# Altium project stm32f103cb_hm.PrjPcb (part 1 of 2)
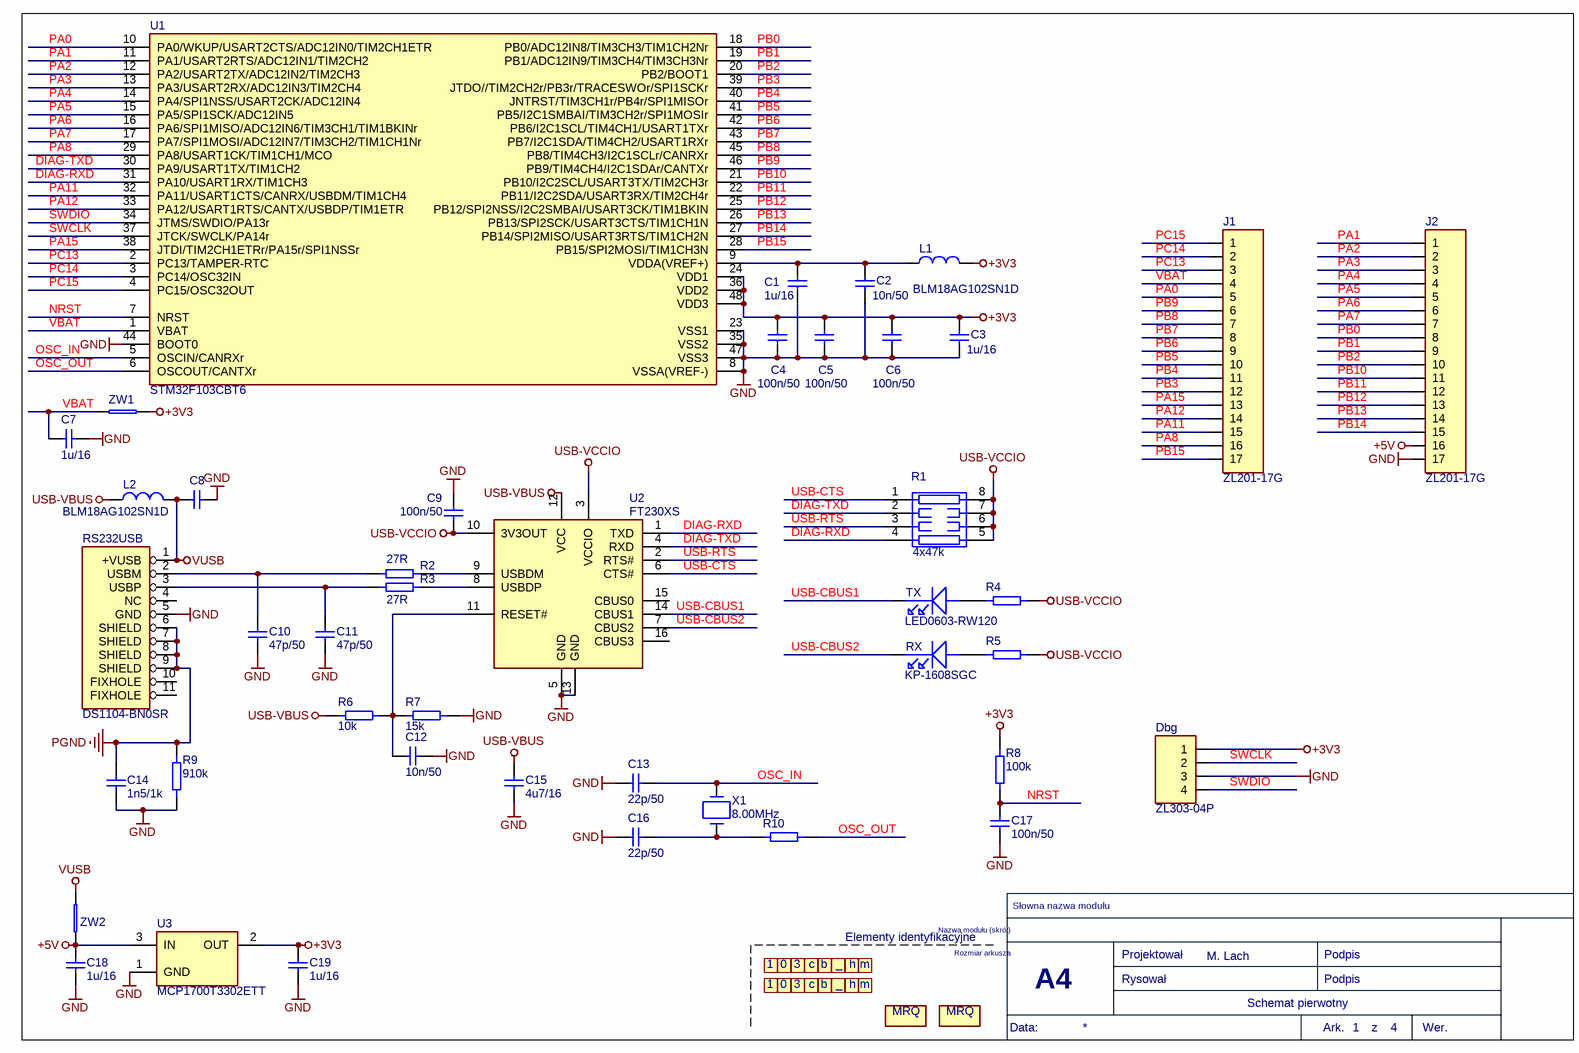
[diagram p0: stm32f103cb_hm_main.SchDoc]
Projektowal: M. Lach
4 sheets, 189 parts. Net scope: global (net labels, ports and power ports of the same name join across sheets).
Board file: stm32f103cb_hm.PcbDoc
Sheets:
  stm32f103cb_hm_main.SchDoc
  stm32f103cb_hm_F100.SchDoc
  stm32f103cb_hm_L073.SchDoc
  stm32f103cb_hm_F051.SchDoc

## Sheet stm32f103cb_hm_main.SchDoc: Schemat pierwotny
size A4; DocumentNumber: 1; SheetNumber: 1; SheetTotal: 4; LotOfPieces: 1

### Parts
(Parts that share a designator on the sheet are numbered #1, #2 ... from top to bottom, then left to right.)
C1#1  1u/16  [0603-IPC]
C2#1  10n/50  [0603-IPC]
C3#1  1u/16  [0603-IPC]
C4#1  100n/50  [0603-IPC]
C5#1  100n/50  [0603-IPC]
C6#1  100n/50  [0603-IPC]
C7#1  1u/16  [0603-IPC]
C8#1  10n/50  [0603-IPC]  (value not drawn)
C9#1  100n/50  [0603-IPC]
C10#1  47p/50  [0603-IPC]
C11#1  47p/50  [0603-IPC]
C12#1  10n/50  [0603-IPC]
C13#1  22p/50  [0603-IPC]
C14#1  1n5/1k  [1210]
C15#1  4u7/16  [0805]
C16#1  22p/50  [0603-IPC]
C17#1  100n/50  [0603-IPC]
C18#1  1u/16  [0603-IPC]
C19  1u/16  [0603-IPC]
Dbg#1  ZL303-04P  [PLMS4S]
J1#1  ZL201-17G  [PLS17S]
J2#1  ZL201-17G  [PLS17S]
L1#1  BLM18AG102SN1D  [0603-IPC]
L2#1  BLM18AG102SN1D  [0603-IPC]
LETTER1  LETTER_1_1m2_m2  [LETTER_1_1m2_m2]  (value not drawn)  (no BOM)
LETTER2  LETTER_0_1m2_m2  [LETTER_0_1m2_m2]  (value not drawn)  (no BOM)
LETTER3  LETTER_3_1m2_m2  [LETTER_3_1m2_m2]  (value not drawn)  (no BOM)
LETTER4  LETTER_C_1m2_m2  [LETTER_C_1m2_m2]  (value not drawn)  (no BOM)
LETTER5  LETTER_B_1M2_M2  [LETTER_B_1M2_M2]  (value not drawn)  (no BOM)
LETTER6  LETTER_UNDERSCORE_1M2_M2  [LETTER_UNDERSCORE_1M2_M2]  (value not drawn)  (no BOM)
LETTER7  LETTER_H_1M2_M2  [LETTER_H_1M2_M2]  (value not drawn)  (no BOM)
LETTER8  LETTER_M_1M2_M2  [LETTER_M_1M2_M2]  (value not drawn)  (no BOM)
LETTER9  LETTER_1_1m2_m2  [LETTER_1_1m2_m2]  (value not drawn)  (no BOM)
LETTER10  LETTER_0_1m2_m2  [LETTER_0_1m2_m2]  (value not drawn)  (no BOM)
LETTER11  LETTER_3_1m2_m2  [LETTER_3_1m2_m2]  (value not drawn)  (no BOM)
LETTER12  LETTER_C_1m2_m2  [LETTER_C_1m2_m2]  (value not drawn)  (no BOM)
LETTER13  LETTER_B_1M2_M2  [LETTER_B_1M2_M2]  (value not drawn)  (no BOM)
LETTER14  LETTER_UNDERSCORE_1M2_M2  [LETTER_UNDERSCORE_1M2_M2]  (value not drawn)  (no BOM)
LETTER15  LETTER_H_1M2_M2  [LETTER_H_1M2_M2]  (value not drawn)  (no BOM)
LETTER16  LETTER_M_1M2_M2  [LETTER_M_1M2_M2]  (value not drawn)  (no BOM)
LOGO1  MRQ_2_8  [MRQ_2_8]  (value not drawn)  (no BOM)
LOGO2  MRQ_2_8  [MRQ_2_8]  (value not drawn)  (no BOM)
R1#1  4x47k  [1206RP]
R2#1  27R  [0603R]
R3#1  27R  [0603R]
R4#1  10k  [0603R]  (value not drawn)
R5#1  10k  [0603R]  (value not drawn)
R6#1  10k  [0603R]
R7#1  15k  [0603R]
R8#1  100k  [0603R]
R9#1  910k  [2512]
R10#1  220R  [0603R]  (value not drawn)
RS232USB  DS1104-BN0SR  [USBMS1B5]
RX#1  KP-1608SGC  [D0603]
TX#1  LED0603-RW120  [D0603]
U1#1  STM32F103CBT6  [MS-026ABC]
U2#1  FT230XS  [MO-137AB]
U3#1  MCP1700T3302ETT  [SOT23-3]
X1#1  8.00MHz  [HC49/4HSMX_THT]
ZW1#1  SHORT0805  [SHORT0805]  (value not drawn)
ZW2#1  SHORT0805  [SHORT0805]  (value not drawn)

### Nets
+3V3: C3#1.1 C4#1.1 C5#1.1 C6#1.1 C19.1 Dbg#1.1 L1#1.2 R8#1.1 U1#1.24(VDD1) U1#1.36(VDD2) U1#1.48(VDD3) U3#1.2(OUT) ZW1#1.2
+5V: C18#1.1 J2#1.16 U3#1.3(IN) ZW2#1.1
GND: C1#1.2 C2#1.2 C3#1.2 C4#1.2 C5#1.2 C6#1.2 C7#1.2 C8#1.1 C9#1.1 C10#1.2 C11#1.2 C12#1.1 C13#1.1 C14#1.2 C15#1.2 C16#1.1 C17#1.2 C18#1.2 C19.2 Dbg#1.3 J2#1.17 R7#1.2 R9#1.2 RS232USB.5(GND) U1#1.8(VSSA(VREF-)) U1#1.23(VSS1) U1#1.35(VSS2) U1#1.44(BOOT0) U1#1.47(VSS3) U2#1.5(GND) U2#1.13(GND) U3#1.1(GND)
PGND: C14#1.1 R9#1.1 RS232USB.6(SHIELD) RS232USB.7(SHIELD) RS232USB.8(SHIELD) RS232USB.9(SHIELD)
USB-VBUS: C15#1.1 L2#1.2 R6#1.1 U2#1.12(VCC)
USB-VCCIO: C9#1.2 R1#1.5(R5) R1#1.6(R6) R1#1.7(R7) R1#1.8(R8) R4#1.2 R5#1.2 U2#1.3(VCCIO) U2#1.10(3V3OUT)
VUSB: C8#1.2 L2#1.1 RS232USB.1(+VUSB) ZW2#1.2
DIAG-RXD: R1#1.4(R4) U1#1.31(PA10/USART1RX/TIM1CH3) U2#1.1(TXD)
DIAG-TXD: R1#1.2(R2) U1#1.30(PA9/USART1TX/TIM1CH2) U2#1.4(RXD)
NRST: C17#1.1 R8#1.2 U1#1.7(NRST)
OSC_IN: C13#1.2 U1#1.5(OSCIN/CANRXr) X1#1.1
OSC_OUT: R10#1.2 U1#1.6(OSCOUT/CANTXr)
PA0: J1#1.5 U1#1.10(PA0/WKUP/USART2CTS/ADC12IN0/TIM2CH1ETR)
PA1: J2#1.1 U1#1.11(PA1/USART2RTS/ADC12IN1/TIM2CH2)
PA2: J2#1.2 U1#1.12(PA2/USART2TX/ADC12IN2/TIM2CH3)
PA3: J2#1.3 U1#1.13(PA3/USART2RX/ADC12IN3/TIM2CH4)
PA4: J2#1.4 U1#1.14(PA4/SPI1NSS/USART2CK/ADC12IN4)
PA5: J2#1.5 U1#1.15(PA5/SPI1SCK/ADC12IN5)
PA6: J2#1.6 U1#1.16(PA6/SPI1MISO/ADC12IN6/TIM3CH1/TIM1BKINr)
PA7: J2#1.7 U1#1.17(PA7/SPI1MOSI/ADC12IN7/TIM3CH2/TIM1CH1Nr)
PA8: J1#1.16 U1#1.29(PA8/USART1CK/TIM1CH1/MCO)
PA11: J1#1.15 U1#1.32(PA11/USART1CTS/CANRX/USBDM/TIM1CH4)
PA12: J1#1.14 U1#1.33(PA12/USART1RTS/CANTX/USBDP/TIM1ETR)
PA15: J1#1.13 U1#1.38(JTDI/TIM2CH1ETRr/PA15r/SPI1NSSr)
PB0: J2#1.8 U1#1.18(PB0/ADC12IN8/TIM3CH3/TIM1CH2Nr)
PB1: J2#1.9 U1#1.19(PB1/ADC12IN9/TIM3CH4/TIM3CH3Nr)
PB2: J2#1.10 U1#1.20(PB2/BOOT1)
PB3: J1#1.12 U1#1.39(JTDO//TIM2CH2r/PB3r/TRACESWOr/SPI1SCKr)
PB4: J1#1.11 U1#1.40(JNTRST/TIM3CH1r/PB4r/SPI1MISOr)
PB5: J1#1.10 U1#1.41(PB5/I2C1SMBAI/TIM3CH2r/SPI1MOSIr)
PB6: J1#1.9 U1#1.42(PB6/I2C1SCL/TIM4CH1/USART1TXr)
PB7: J1#1.8 U1#1.43(PB7/I2C1SDA/TIM4CH2/USART1RXr)
PB8: J1#1.7 U1#1.45(PB8/TIM4CH3/I2C1SCLr/CANRXr)
PB9: J1#1.6 U1#1.46(PB9/TIM4CH4/I2C1SDAr/CANTXr)
PB10: J2#1.11 U1#1.21(PB10/I2C2SCL/USART3TX/TIM2CH3r)
PB11: J2#1.12 U1#1.22(PB11/I2C2SDA/USART3RX/TIM2CH4r)
PB12: J2#1.13 U1#1.25(PB12/SPI2NSS/I2C2SMBAI/USART3CK/TIM1BKIN)
PB13: J2#1.14 U1#1.26(PB13/SPI2SCK/USART3CTS/TIM1CH1N)
PB14: J2#1.15 U1#1.27(PB14/SPI2MISO/USART3RTS/TIM1CH2N)
PB15: J1#1.17 U1#1.28(PB15/SPI2MOSI/TIM1CH3N)
PC13: J1#1.3 U1#1.2(PC13/TAMPER-RTC)
PC14: J1#1.2 U1#1.3(PC14/OSC32IN)
PC15: J1#1.1 U1#1.4(PC15/OSC32OUT)
SWCLK: Dbg#1.2 U1#1.37(JTCK/SWCLK/PA14r)
SWDIO: Dbg#1.4 U1#1.34(JTMS/SWDIO/PA13r)
USB-CBUS1: TX#1.CATH U2#1.14(CBUS1)
USB-CBUS2: RX#1.CATH U2#1.7(CBUS2)
USB-CTS: R1#1.1(R1) U2#1.6(CTS#)
USB-RTS: R1#1.3(R3) U2#1.2(RTS#)
VBAT: C7#1.1 J1#1.4 U1#1.1(VBAT) ZW1#1.1
NetC1#1_1: C1#1.1 C2#1.1 L1#1.1 U1#1.9(VDDA(VREF+))
NetC10#1_1: C10#1.1 R2#1.1 RS232USB.2(USBM)
NetC11#1_1: C11#1.1 R3#1.1 RS232USB.3(USBP)
NetC12#1_2: C12#1.2 R6#1.2 R7#1.1 U2#1.11(RESET#)
NetC16#1_2: C16#1.2 R10#1.1 X1#1.2
NetR2#1_2: R2#1.2 U2#1.9(USBDM)
NetR3#1_2: R3#1.2 U2#1.8(USBDP)
NetR4#1_1: R4#1.1 TX#1.ANOD
NetR5#1_1: R5#1.1 RX#1.ANOD

Not connected (* = marked no-connect by the designer): RS232USB 4(NC) 10(FIXHOLE) 11(FIXHOLE); U2#1 15(CBUS0) 16(CBUS3)

### Notes on the sheet
- Elementy identyfikacyjne
- Nazwa modułu (skrót)
- Słowna nazwa modułu
- Rozmiar arkusza
- A4
- Projektował
- Rysował
- Podpis
- Data:
- Ark.
- z
- Wer.
- (in symbol NOB5) MRQ
- (in symbol NOB8) 0
- (in symbol NOB9) 1
- (in symbol NOB11) 3
- (in symbol NOB13) c
- (in symbol NOB15) b
- (in symbol NOB17) _
- (in symbol NOB19) h
- (in symbol NOB21) m

### Library data of the parts
C1#1 C3#1 C18#1 C19 = CAP37: Descript: Kondensator: ceramiczny; MLCC; 1uF; 16V; X7R; ±10%; SMD; 0603; Reference5: CL10B105KO8NNNC; Kod: CAP37; ID: 37; Value: 1u/16; Supplier5: tme.pl; Manufacturer5: Samsung; Typ5: CL10B105KO8NNNC; Price5: 0,07; DateOfPrice5: 2020-05-10
C2#1 C8#1 C12#1 = CAP20: Descript: Kondensator: ceramiczny; MLCC; 10nF; 50V; X7R; ±10%; SMD; 0603; Reference5: 06035C103KAT2A; Kod: CAP20; ID: 20; Value: 10n/50; Supplier5: tme.pl; Manufacturer5: AVX; Typ5: 06035C103KAT2A; Price5: 0,08; DateOfPrice5: 2020-05-10
C4#1 C5#1 C6#1 C9#1 C17#1 = CAP6: Descript: Kondensator: ceramiczny; MLCC; 100nF; 50V; X7R; ±5%; SMD; 0603; Reference5: CL10B104JB8NNNC; Kod: CAP6; ID: 6; Value: 100n/50; Supplier5: tme.pl; Manufacturer5: Samsung; Typ5: CL10B104JB8NNNC; Price5: 0,25; DateOfPrice5: 2020-05-10
C7#1 = CAP37: Kod: CAP37; ID: 37; Descript: Kondensator: ceramiczny; MLCC; 1uF; 16V; X7R; ±10%; SMD; 0603; Reference5: CL10B105KO8NNNC; Value: 1u/16; Price5: 0,07; DateOfPrice5: 2020-05-10; Supplier5: tme.pl; Manufacturer5: Samsung; Typ5: CL10B105KO8NNNC
C10#1 C11#1 = CAP85: Descript: Kondensator: ceramiczny; MLCC; 47pF; 50V; C0G; ±5%; SMD; 0603; Reference5: CC0603JRNPO9470; Typ5: CC0603JRNPO9BN470; Kod: CAP85; ID: 85; Value: 47p/50; Supplier5: tme.pl; Manufacturer5: Yageo; Price5: 0,08; DateOfPrice5: 2020-05-10
C13#1 C16#1 = CAP53: Descript: Kondensator: ceramiczny; MLCC; 22pF; 50V; C0G; ±5%; SMD; 0603; Reference5: CC0603JRNPO9220; Typ5: CC0603JRNPO9BN220; Kod: CAP53; ID: 53; Value: 22p/50; Supplier5: tme.pl; Manufacturer5: Yageo; Price5: 0; DateOfPrice5: 2010-01-01
C14#1 = CAP35: Descript: Ceramiczny kondensator wielowarstw. SMD, 1210 [jedn. metryczne: 3225], 1500 pF, 1 kV, ± 10%, X7R; Reference5: 1855964; Typ5: MCCA000836; Kod: CAP35; ID: 35; Value: 1n5/1k; DateOfPrice5: 2020-05-10; Manufacturer5: MULTICOMP; Price5: 2,4; Supplier5: farnell.com
C15#1 = CAP97: Descript: Kondensator: ceramiczny; MLCC; 4,7uF; 16VDC; X7R; ±5%; SMD; 0805; Reference5: C0805C475J4RACAUTO; Kod: CAP97; ID: 97; Value: 4u7/16; Supplier5: tme.pl; Manufacturer5: Kemet; Typ5: C0805C475J4RACAUTO; Price5: 1,5; DateOfPrice5: 2020-05-10
Dbg#1 = Con298: Descript: Listwa kołkowa; kołkowe; męskie; PIN:4; proste; 2mm; THT; 1x4; Kod: Con298; ID: 298; Replacement: bd; Value: ZL303-04P; Supplier5: tme.pl; Reference5: ZL303-04P; Manufacturer5: Ninigi; Typ5: ZL303-04P; Price5: 0,2; DateOfPrice5: 2020-05-10
J1#1 J2#1 = CON82: Kod: CON82; ID: 82; Descript: Listwa kołkowa; kołkowe; męskie; PIN: 20; proste; 2,54mm; THT; 1x20; Reference5: ZL201-20G; Typ5: DS1021-1*20SF11; Replacement: bd; Value: ZL201-17G; Price5: 1; DateOfPrice5: 2020-12-08; Supplier5: tme; Manufacturer5: Connfly
L1#1 L2#1 = Ind41: Descript: Ferryt: koralik; Imp.@ 100MHz:1000om; Montaż: SMD; 0,4A; Obud:0603; Kod: Ind41; ID: 41; Value: BLM18AG102SN1D; Supplier5: tme.pl; Reference5: BLM18AG102SN1D; Manufacturer5: Murata; Typ5: BLM18AG102SN1D; Price5: 0; DateOfPrice5: 2020-05-10; InductCurr: -
LETTER1 LETTER9 = NOB9: Kod: NOB9; ID: 9; Descript: bd; Value: LETTER_1_1m2_m2
LETTER2 LETTER10 = NOB8: Kod: NOB8; ID: 8; Descript: bd; Value: LETTER_0_1m2_m2
LETTER3 LETTER11 = NOB11: Kod: NOB11; ID: 11; Descript: bd; Value: LETTER_3_1m2_m2
LETTER4 LETTER12 = NOB13: Kod: NOB13; ID: 13; Descript: bd; Value: LETTER_C_1m2_m2
LETTER5 LETTER13 = NOB15: Kod: NOB15; ID: 15; Descript: bd; Value: LETTER_B_1M2_M2
LETTER6 LETTER14 = NOB17: Kod: NOB17; ID: 17; Descript: bd; Value: LETTER_UNDERSCORE_1M2_M2
LETTER7 LETTER15 = NOB19: Kod: NOB19; ID: 19; Descript: bd; Value: LETTER_H_1M2_M2
LETTER8 LETTER16 = NOB21: Kod: NOB21; ID: 21; Descript: bd; Value: LETTER_M_1M2_M2
LOGO1 LOGO2 = NOB5: Kod: NOB5; ID: 5; Descript: bd; Value: MRQ_2_8
R1#1 = Res182: Descript: Drabinka rezystorowa: Y; 47kΩ; SMD; 1206; Il.rezystorów:4; 63mW; Reference5: DR1206-47K-4/8; Typ5: 4D03WGJ0473T; Kod: Res182; ID: 182; Value: 4x47k; Supplier5: tme.pl; Manufacturer5: Royal Ohm; Price5: 0,1; DateOfPrice5: 2020-05-10
R2#1 R3#1 = Res106: Descript: Rezystor: thick film; SMD; 0603; 27Ω; 0,1W; ±1%; -55÷125°C; Reference5: SMD0603-27R-1%; Typ5: 0603SAF270JT5E; Kod: Res106; ID: 106; Value: 27R; Supplier5: tme.pl; Manufacturer5: Royal Ohm; Price5: 0,1; DateOfPrice5: 2020-05-10
R4#1 R5#1 R6#1 = Res15: Descript: Rezystor: thick film; SMD; 0603; 10kom; 0,1W; ±1%; -55÷125°C; Reference5: SMD0603-10K-1%; Typ5: 0603WGF 10K T5E; Kod: Res15; ID: 15; Value: 10k; Supplier5: tme.pl; Manufacturer5: Royal Ohm; Price5: 0,08; DateOfPrice5: 2020-05-10
R7#1 = Res39: Descript: Rezystor: thick film; SMD; 0603; 15kΩ; 0,1W; ±1%; -55÷125°C; Reference5: SMD0603-15K-1%; Typ5: 0603WGF15KT5E; Kod: Res39; ID: 39; Value: 15k; Supplier5: tme.pl; Manufacturer5: Royal Ohm; Price5: 0,08; DateOfPrice5: 2020-05-10
R8#1 = Res9: Descript: Rezystor: thick film; SMD; 0603; 100kom; 0,1W; ±1%; -55÷125°C; Reference5: SMD0603-100K-1%; Typ5: 0603SAF1003T5E; Kod: Res9; ID: 9; Value: 100k; Supplier5: tme.pl; Manufacturer5: Royal Ohm; Price5: 0,1; DateOfPrice5: 2020-06-25
R9#1 = Res235: Descript: Rezystor SMD, grubowarstwowy, 2512 [jedn. metryczne: 6432], 910 kohm, Seria ERJU1T, 200 V; Reference5: 2381073; Typ5: ERJU1TF9103U; Kod: Res235; ID: 235; Value: 910k; Supplier5: farnell; Price5: 1,14; DateOfPrice5: 2020-05-10; Manufacturer5: Panasonic
R10#1 = Res87: Descript: Rezystor: thick film; SMD; 0603; 220om; 0,1W; ±1%; -55÷125°C; Reference5: SMD0603-220R-1%; Typ5: 0603SAF2200T5E; Kod: Res87; ID: 87; Value: 220R; Supplier5: tme.pl; Manufacturer5: Royal Ohm; Price5: 0,1; DateOfPrice5: 2020-06-25
RS232USB = Con41: Descript: Gniazdo; USB B mini; SMT; PIN: 5; poziome; Opakowanie: taśma; Reference5: MUSB-G5P; Replacement: bd; Kod: Con41; ID: 41; Value: DS1104-BN0SR; Supplier5: tme.pl; Manufacturer5: Connfly; Price5: 2; DateOfPrice5: 2010-01-01; Typ5: DS1104-BN0SR
RX#1 = Opt8: Descript: LED; SMD; 0603; zielony; 4-15mcd; 120°; 1,6x0,8mm; Kod: Opt8; ID: 8; Value: KP-1608SGC; Supplier5: tme.pl; Reference5: KP-1608SGC; Manufacturer5: Kingbright Electronic; Typ5: KP-1608SGC; Price5: 0,8; DateOfPrice5: 2020-05-10
TX#1 = Opt25: Descript: Dioda LED, SMD 0603, Czerwona 626-636nm, 50-70 mCd /10mA, water clear, 120°; Kod: Opt25; ID: 25; Value: LED0603-RW120; Supplier5: maritex.com.pl; Reference5: LED0603-RW120; Typ5: LED0603-RW120; Price5: 0,12; DateOfPrice5: 2020-05-10; Manufacturer5: Honglitronic
U1#1 = ICs272: Kod: ICs272; ID: 272; Descript: ARM Cortex-M3 CPU, 128kB Flash, 20kB RAM, USB, CAN, 3xUART, 2xI2C, 2xSPI, ADC, STM, LQFP48, RoHS; Reference5: 42865; Value: STM32F103CBT6; Price5: 13; DateOfPrice5: 2020-05-10; Supplier5: kamami.pl; Manufacturer5: ST; Typ5: STM32F103CBT6
U2#1 = ICs109: Descript: Interfejs; USB-basic UART; Ilość pinów CBUS:4; tuba; SSOP16; Reference5: FT230XS-R; Kod: ICs109; ID: 109; Value: FT230XS; Supplier5: tme.pl; Manufacturer5: FTDI; Typ5: FT230XS-R; Price5: 8,8; DateOfPrice5: 2020-05-10
U3#1 = ICs182: Kod: ICs182; ID: 182; Descript: Stabilizator napięcia; LDO, nieregulowany; 3,3V; 0,25A; SOT23-3; Typ5: MCP1700T3302E/TT; Value: MCP1700T3302ETT; Price5: 1,8; DateOfPrice5: 2020-05-10; Supplier5: tme.pl; Reference5: MCP1700T3302ETT; Manufacturer5: Microchip
X1#1 = Qua16: Descript: Rezonator: kwarcowy; 8MHz; ±30ppm; 20pF; SMD; HC49SM; Reference5: 8.00M-SMDHC49S; Kod: Qua16; ID: 16; Value: 8.00MHz; Supplier5: tme.pl; Manufacturer5: YIC; Price5: 2; DateOfPrice5: 2020-05-10; Freq: -
ZW1#1 ZW2#1 = Res238: Kod: Res238; ID: 238; Descript: Przewlekana zwora z drutu na planie rezystora 0805; Value: SHORT0805; Price5: 0,1; Supplier5: -; Reference5: -; Manufacturer5: -; Typ5: -

## Sheet stm32f103cb_hm_F100.SchDoc: Schemat z procesorem STM32F100CBT6
size A4; DocumentNumber: 2; SheetNumber: 2; SheetTotal: 4; LotOfPieces: 1
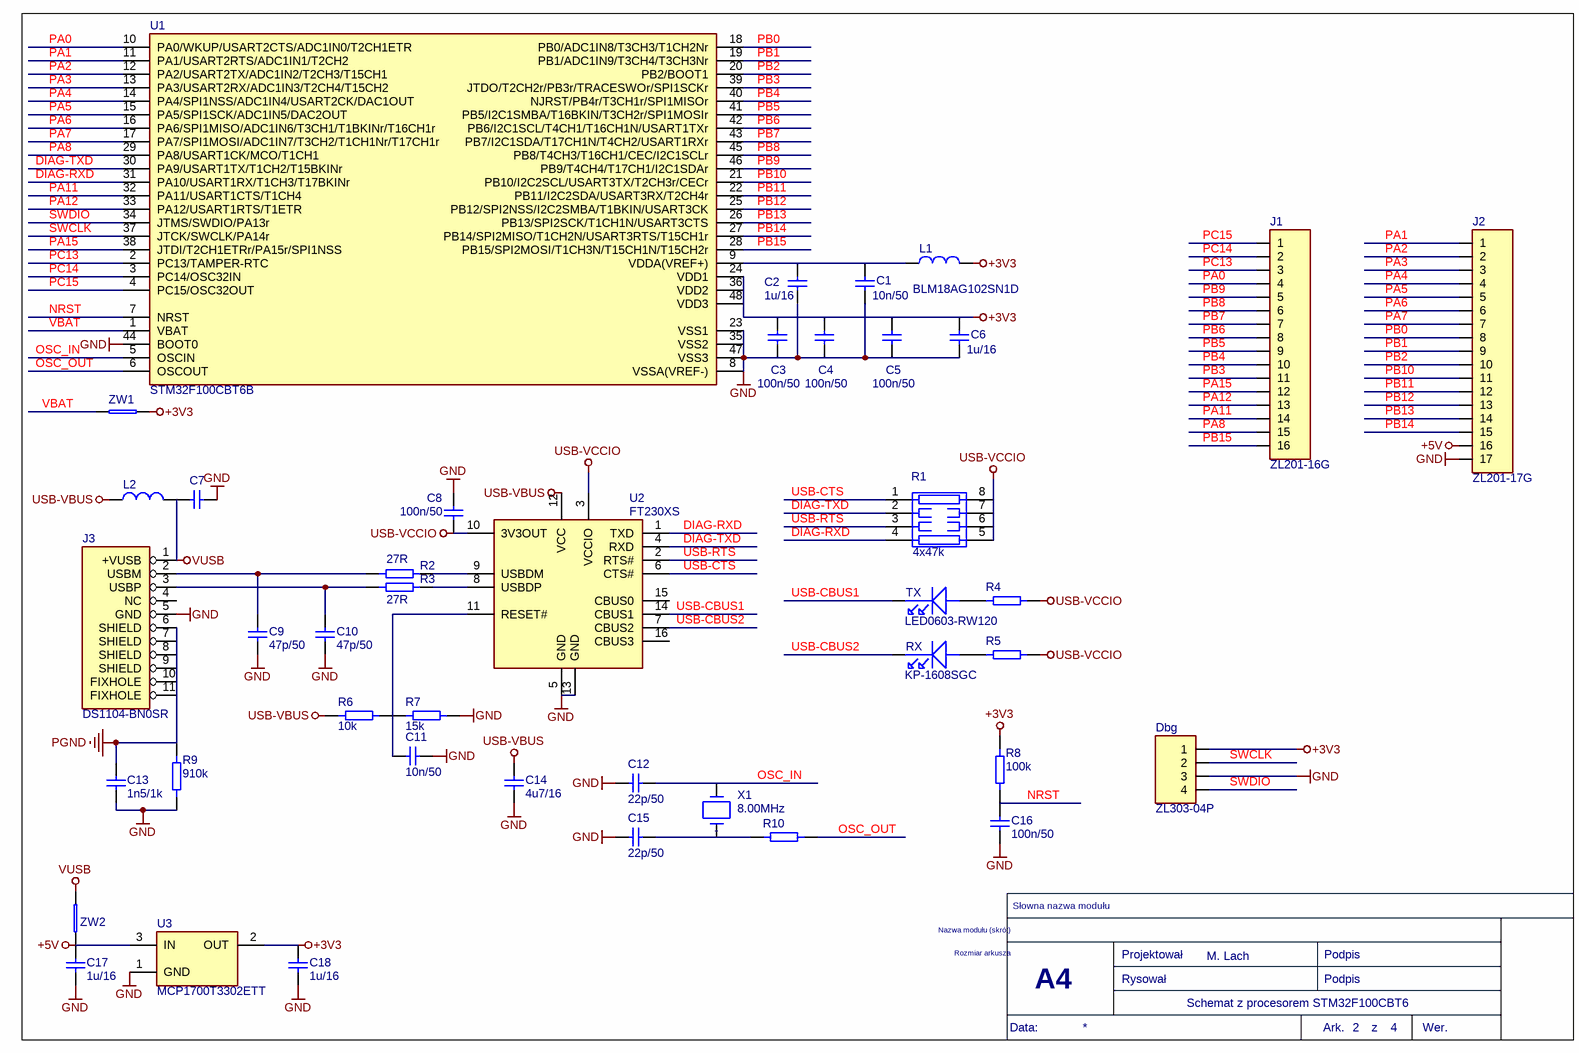
[diagram p1: stm32f103cb_hm_F100.SchDoc]

### Parts
(Parts that share a designator on the sheet are numbered #1, #2 ... from top to bottom, then left to right.)
C1#2  10n/50  [0603-IPC]  (graphical)
C2#2  1u/16  [0603-IPC]  (graphical)
C3#2  100n/50  [0603-IPC]  (graphical)
C4#2  100n/50  [0603-IPC]  (graphical)
C5#2  100n/50  [0603-IPC]  (graphical)
C6#2  1u/16  [0603-IPC]  (graphical)
C7#2  10n/50  [0603-IPC]  (value not drawn)  (graphical)
C8#2  100n/50  [0603-IPC]  (graphical)
C9#2  47p/50  [0603-IPC]  (graphical)
C10#2  47p/50  [0603-IPC]  (graphical)
C11#2  10n/50  [0603-IPC]  (graphical)
C12#2  22p/50  [0603-IPC]  (graphical)
C13#2  1n5/1k  [1210]  (graphical)
C14#2  4u7/16  [0805]  (graphical)
C15#2  22p/50  [0603-IPC]  (graphical)
C16#2  100n/50  [0603-IPC]  (graphical)
C17#2  1u/16  [0603-IPC]  (graphical)
C18#2  1u/16  [0603-IPC]  (graphical)
Dbg#2  ZL303-04P  [PLMS4S]  (graphical)
J1#2  ZL201-16G  [PLS16S]  (graphical)
J2#2  ZL201-17G  [PLS17S]  (graphical)
J3#1  DS1104-BN0SR  [USBMS1B5]  (graphical)
L1#2  BLM18AG102SN1D  [0603-IPC]  (graphical)
L2#2  BLM18AG102SN1D  [0603-IPC]  (value not drawn)  (graphical)
R1#2  4x47k  [1206RP]  (graphical)
R2#2  27R  [0603R]  (graphical)
R3#2  27R  [0603R]  (graphical)
R4#2  10k  [0603R]  (value not drawn)  (graphical)
R5#2  10k  [0603R]  (value not drawn)  (graphical)
R6#2  10k  [0603R]  (graphical)
R7#2  15k  [0603R]  (graphical)
R8#2  100k  [0603R]  (graphical)
R9#2  910k  [2512]  (graphical)
R10#2  220R  [0603R]  (value not drawn)  (graphical)
RX#2  KP-1608SGC  [D0603]  (graphical)
TX#2  LED0603-RW120  [D0603]  (graphical)
U1#2  STM32F100CBT6B  [MS-026ABC]  (graphical)
U2#2  FT230XS  [MO-137AB]  (graphical)
U3#2  MCP1700T3302ETT  [SOT23-3]  (graphical)
X1#2  8.00MHz  [HC49/4HSMX_THT]  (graphical)
ZW1#2  SHORT0805  [SHORT0805]  (value not drawn)  (graphical)
ZW2#2  SHORT0805  [SHORT0805]  (value not drawn)  (graphical)

### Nets
+3V3: C3#2.1 C4#2.1 C5#2.1 C6#2.1 C18#2.1 Dbg#2.1 L1#2.2 R8#2.1 U1#2.24(VDD1) U1#2.36(VDD2) U1#2.48(VDD3) U3#2.2(OUT) ZW1#2.2
+5V: C17#2.1 J2#2.16 U3#2.3(IN) ZW2#2.1
GND: C1#2.2 C2#2.2 C3#2.2 C4#2.2 C5#2.2 C6#2.2 C7#2.1 C8#2.1 C9#2.2 C10#2.2 C11#2.1 C12#2.1 C13#2.2 C14#2.2 C15#2.1 C16#2.2 C17#2.2 C18#2.2 Dbg#2.3 J2#2.17 J3#1.5(GND) R7#2.2 R9#2.2 U1#2.8(VSSA(VREF-)) U1#2.23(VSS1) U1#2.35(VSS2) U1#2.44(BOOT0) U1#2.47(VSS3) U2#2.5(GND) U2#2.13(GND) U3#2.1(GND)
PGND: C13#2.1 J3#1.6(SHIELD) J3#1.7(SHIELD) J3#1.8(SHIELD) J3#1.9(SHIELD) J3#1.10(FIXHOLE) J3#1.11(FIXHOLE) R9#2.1
USB-VBUS: C14#2.1 L2#2.2 R6#2.1 U2#2.12(VCC)
USB-VCCIO: C8#2.2 R1#2.5(R5) R1#2.6(R6) R1#2.7(R7) R1#2.8(R8) R4#2.2 R5#2.2 U2#2.3(VCCIO) U2#2.10(3V3OUT)
VUSB: C7#2.2 J3#1.1(+VUSB) L2#2.1 ZW2#2.2
DIAG-RXD: R1#2.4(R4) U1#2.31(PA10/USART1RX/T1CH3/T17BKINr) U2#2.1(TXD)
DIAG-TXD: R1#2.2(R2) U1#2.30(PA9/USART1TX/T1CH2/T15BKINr) U2#2.4(RXD)
NRST: C16#2.1 R8#2.2 U1#2.7(NRST)
OSC_IN: C12#2.2 U1#2.5(OSCIN) X1#2.1
OSC_OUT: R10#2.2 U1#2.6(OSCOUT)
PA0: J1#2.4 U1#2.10(PA0/WKUP/USART2CTS/ADC1IN0/T2CH1ETR)
PA1: J2#2.1 U1#2.11(PA1/USART2RTS/ADC1IN1/T2CH2)
PA2: J2#2.2 U1#2.12(PA2/USART2TX/ADC1IN2/T2CH3/T15CH1)
PA3: J2#2.3 U1#2.13(PA3/USART2RX/ADC1IN3/T2CH4/T15CH2)
PA4: J2#2.4 U1#2.14(PA4/SPI1NSS/ADC1IN4/USART2CK/DAC1OUT)
PA5: J2#2.5 U1#2.15(PA5/SPI1SCK/ADC1IN5/DAC2OUT)
PA6: J2#2.6 U1#2.16(PA6/SPI1MISO/ADC1IN6/T3CH1/T1BKINr/T16CH1r)
PA7: J2#2.7 U1#2.17(PA7/SPI1MOSI/ADC1IN7/T3CH2/T1CH1Nr/T17CH1r)
PA8: J1#2.15 U1#2.29(PA8/USART1CK/MCO/T1CH1)
PA11: J1#2.14 U1#2.32(PA11/USART1CTS/T1CH4)
PA12: J1#2.13 U1#2.33(PA12/USART1RTS/T1ETR)
PA15: J1#2.12 U1#2.38(JTDI/T2CH1ETRr/PA15r/SPI1NSS)
PB0: J2#2.8 U1#2.18(PB0/ADC1IN8/T3CH3/T1CH2Nr)
PB1: J2#2.9 U1#2.19(PB1/ADC1IN9/T3CH4/T3CH3Nr)
PB2: J2#2.10 U1#2.20(PB2/BOOT1)
PB3: J1#2.11 U1#2.39(JTDO/T2CH2r/PB3r/TRACESWOr/SPI1SCKr)
PB4: J1#2.10 U1#2.40(NJRST/PB4r/T3CH1r/SPI1MISOr)
PB5: J1#2.9 U1#2.41(PB5/I2C1SMBA/T16BKIN/T3CH2r/SPI1MOSIr)
PB6: J1#2.8 U1#2.42(PB6/I2C1SCL/T4CH1/T16CH1N/USART1TXr)
PB7: J1#2.7 U1#2.43(PB7/I2C1SDA/T17CH1N/T4CH2/USART1RXr)
PB8: J1#2.6 U1#2.45(PB8/T4CH3/T16CH1/CEC/I2C1SCLr)
PB9: J1#2.5 U1#2.46(PB9/T4CH4/T17CH1/I2C1SDAr)
PB10: J2#2.11 U1#2.21(PB10/I2C2SCL/USART3TX/T2CH3r/CECr)
PB11: J2#2.12 U1#2.22(PB11/I2C2SDA/USART3RX/T2CH4r)
PB12: J2#2.13 U1#2.25(PB12/SPI2NSS/I2C2SMBA/T1BKIN/USART3CK)
PB13: J2#2.14 U1#2.26(PB13/SPI2SCK/T1CH1N/USART3CTS)
PB14: J2#2.15 U1#2.27(PB14/SPI2MISO/T1CH2N/USART3RTS/T15CH1r)
PB15: J1#2.16 U1#2.28(PB15/SPI2MOSI/T1CH3N/T15CH1N/T15CH2r)
PC13: J1#2.3 U1#2.2(PC13/TAMPER-RTC)
PC14: J1#2.2 U1#2.3(PC14/OSC32IN)
PC15: J1#2.1 U1#2.4(PC15/OSC32OUT)
SWCLK: Dbg#2.2 U1#2.37(JTCK/SWCLK/PA14r)
SWDIO: Dbg#2.4 U1#2.34(JTMS/SWDIO/PA13r)
USB-CBUS1: TX#2.CATH U2#2.14(CBUS1)
USB-CBUS2: RX#2.CATH U2#2.7(CBUS2)
USB-CTS: R1#2.1(R1) U2#2.6(CTS#)
USB-RTS: R1#2.3(R3) U2#2.2(RTS#)
VBAT: U1#2.1(VBAT) ZW1#2.1
NetC1#2_1: C1#2.1 C2#2.1 L1#2.1 U1#2.9(VDDA(VREF+))
NetC9#2_1: C9#2.1 J3#1.2(USBM) R2#2.1
NetC10#2_1: C10#2.1 J3#1.3(USBP) R3#2.1
NetC11#2_2: C11#2.2 R6#2.2 R7#2.1 U2#2.11(RESET#)
NetC15#2_2: C15#2.2 R10#2.1 X1#2.2
NetR2#2_2: R2#2.2 U2#2.9(USBDM)
NetR3#2_2: R3#2.2 U2#2.8(USBDP)
NetR4#2_1: R4#2.1 TX#2.ANOD
NetR5#2_1: R5#2.1 RX#2.ANOD

Not connected (* = marked no-connect by the designer): J3#1 4(NC); U2#2 15(CBUS0) 16(CBUS3)

### Notes on the sheet
- Nazwa modułu (skrót)
- Słowna nazwa modułu
- Rozmiar arkusza
- A4
- Projektował
- Rysował
- Podpis
- Data:
- Ark.
- z
- Wer.

### Library data of the parts
C1#2 C7#2 C11#2 = CAP20: as C2#1 on sheet stm32f103cb_hm_main; Value: 10n/50; Supplier5: tme.pl; Manufacturer5: AVX; Typ5: 06035C103KAT2A; Price5: 0,08; DateOfPrice5: 2020-05-10
C2#2 C6#2 C17#2 C18#2 = CAP37: as C1#1 on sheet stm32f103cb_hm_main; Value: 1u/16; Supplier5: tme.pl; Manufacturer5: Samsung; Typ5: CL10B105KO8NNNC; Price5: 0,07; DateOfPrice5: 2020-05-10
C3#2 C4#2 C5#2 C8#2 C16#2 = CAP6: as C4#1 on sheet stm32f103cb_hm_main; Value: 100n/50; Supplier5: tme.pl; Manufacturer5: Samsung; Typ5: CL10B104JB8NNNC; Price5: 0,25; DateOfPrice5: 2020-05-10
C9#2 C10#2 = CAP85: as C10#1 on sheet stm32f103cb_hm_main; Value: 47p/50; Supplier5: tme.pl; Manufacturer5: Yageo; Price5: 0,08; DateOfPrice5: 2020-05-10
C12#2 C15#2 = CAP53: as C13#1 on sheet stm32f103cb_hm_main; Value: 22p/50; Supplier5: tme.pl; Manufacturer5: Yageo; Price5: 0; DateOfPrice5: 2010-01-01
C13#2 = CAP35: as C14#1 on sheet stm32f103cb_hm_main; Value: 1n5/1k; DateOfPrice5: 2020-05-10; Manufacturer5: MULTICOMP; Price5: 2,4; Supplier5: farnell.com
C14#2 = CAP97: as C15#1 on sheet stm32f103cb_hm_main; Value: 4u7/16; Supplier5: tme.pl; Manufacturer5: Kemet; Typ5: C0805C475J4RACAUTO; Price5: 1,5; DateOfPrice5: 2020-05-10
Dbg#2 = Con298: as Dbg#1 on sheet stm32f103cb_hm_main; Value: ZL303-04P; Supplier5: tme.pl; Reference5: ZL303-04P; Manufacturer5: Ninigi; Typ5: ZL303-04P; Price5: 0,2; DateOfPrice5: 2020-05-10
J1#2 = CON81: Kod: CON81; ID: 81; Descript: Listwa kołkowa; kołkowe; męskie; PIN: 16; proste; 2,54mm; THT; 1x16; Typ5: DS1021-1*16SF11; Replacement: bd; Value: ZL201-16G; Price5: 0,7; DateOfPrice5: 2020-12-08; Supplier5: tme; Reference5: ZL201-16G; Manufacturer5: Connfly
J2#2 = CON82: as J1#1 on sheet stm32f103cb_hm_main; Value: ZL201-17G; Price5: 1; DateOfPrice5: 2020-12-08; Supplier5: tme; Manufacturer5: Connfly
J3#1 = Con41: as RS232USB on sheet stm32f103cb_hm_main; Value: DS1104-BN0SR; Supplier5: tme.pl; Manufacturer5: Connfly; Price5: 2; DateOfPrice5: 2010-01-01; Typ5: DS1104-BN0SR
L1#2 L2#2 = Ind41: as L1#1 on sheet stm32f103cb_hm_main; Value: BLM18AG102SN1D; Supplier5: tme.pl; Reference5: BLM18AG102SN1D; Manufacturer5: Murata; Typ5: BLM18AG102SN1D; Price5: 0; DateOfPrice5: 2020-05-10; InductCurr: -
R1#2 = Res182: as R1#1 on sheet stm32f103cb_hm_main; Value: 4x47k; Supplier5: tme.pl; Manufacturer5: Royal Ohm; Price5: 0,1; DateOfPrice5: 2020-05-10
R2#2 R3#2 = Res106: as R2#1 on sheet stm32f103cb_hm_main; Value: 27R; Supplier5: tme.pl; Manufacturer5: Royal Ohm; Price5: 0,1; DateOfPrice5: 2020-05-10
R4#2 R5#2 R6#2 = Res15: as R4#1 on sheet stm32f103cb_hm_main; Value: 10k; Supplier5: tme.pl; Manufacturer5: Royal Ohm; Price5: 0,08; DateOfPrice5: 2020-05-10
R7#2 = Res39: as R7#1 on sheet stm32f103cb_hm_main; Value: 15k; Supplier5: tme.pl; Manufacturer5: Royal Ohm; Price5: 0,08; DateOfPrice5: 2020-05-10
R8#2 = Res9: as R8#1 on sheet stm32f103cb_hm_main; Value: 100k; Supplier5: tme.pl; Manufacturer5: Royal Ohm; Price5: 0,1; DateOfPrice5: 2020-06-25
R9#2 = Res235: as R9#1 on sheet stm32f103cb_hm_main; Value: 910k; Supplier5: farnell; Price5: 1,14; DateOfPrice5: 2020-05-10; Manufacturer5: Panasonic
R10#2 = Res87: as R10#1 on sheet stm32f103cb_hm_main; Value: 220R; Supplier5: tme.pl; Manufacturer5: Royal Ohm; Price5: 0,1; DateOfPrice5: 2020-06-25
RX#2 = Opt8: as RX#1 on sheet stm32f103cb_hm_main; Value: KP-1608SGC; Supplier5: tme.pl; Reference5: KP-1608SGC; Manufacturer5: Kingbright Electronic; Typ5: KP-1608SGC; Price5: 0,8; DateOfPrice5: 2020-05-10
TX#2 = Opt25: as TX#1 on sheet stm32f103cb_hm_main; Value: LED0603-RW120; Supplier5: maritex.com.pl; Reference5: LED0603-RW120; Typ5: LED0603-RW120; Price5: 0,12; DateOfPrice5: 2020-05-10; Manufacturer5: Honglitronic
U1#2 = ICs268: Kod: ICs268; ID: 268; Descript: MCU, 32BIT, CORTEXM3, 128K FLASH, 48LQFP; Reference5: 1838512; Value: STM32F100CBT6B; Price5: 15; DateOfPrice5: 2010-01-01; Supplier5: farnell.com; Manufacturer5: ST; Typ5: STM32F100CBT6B
U2#2 = ICs109: as U2#1 on sheet stm32f103cb_hm_main; Value: FT230XS; Supplier5: tme.pl; Manufacturer5: FTDI; Typ5: FT230XS-R; Price5: 8,8; DateOfPrice5: 2020-05-10
U3#2 = ICs182: as U3#1 on sheet stm32f103cb_hm_main; Value: MCP1700T3302ETT; Price5: 1,8; DateOfPrice5: 2020-05-10; Supplier5: tme.pl; Reference5: MCP1700T3302ETT; Manufacturer5: Microchip
X1#2 = Qua16: as X1#1 on sheet stm32f103cb_hm_main; Value: 8.00MHz; Supplier5: tme.pl; Manufacturer5: YIC; Price5: 2; DateOfPrice5: 2020-05-10; Freq: -
ZW1#2 ZW2#2 = Res238: as ZW1#1 on sheet stm32f103cb_hm_main; Value: SHORT0805; Price5: 0,1; Supplier5: -; Reference5: -; Manufacturer5: -; Typ5: -

## Sheet stm32f103cb_hm_L073.SchDoc: Schemat z procesorem STM32L073CZT6
size A4; DocumentNumber: 3; SheetNumber: 3; SheetTotal: 4; LotOfPieces: 1
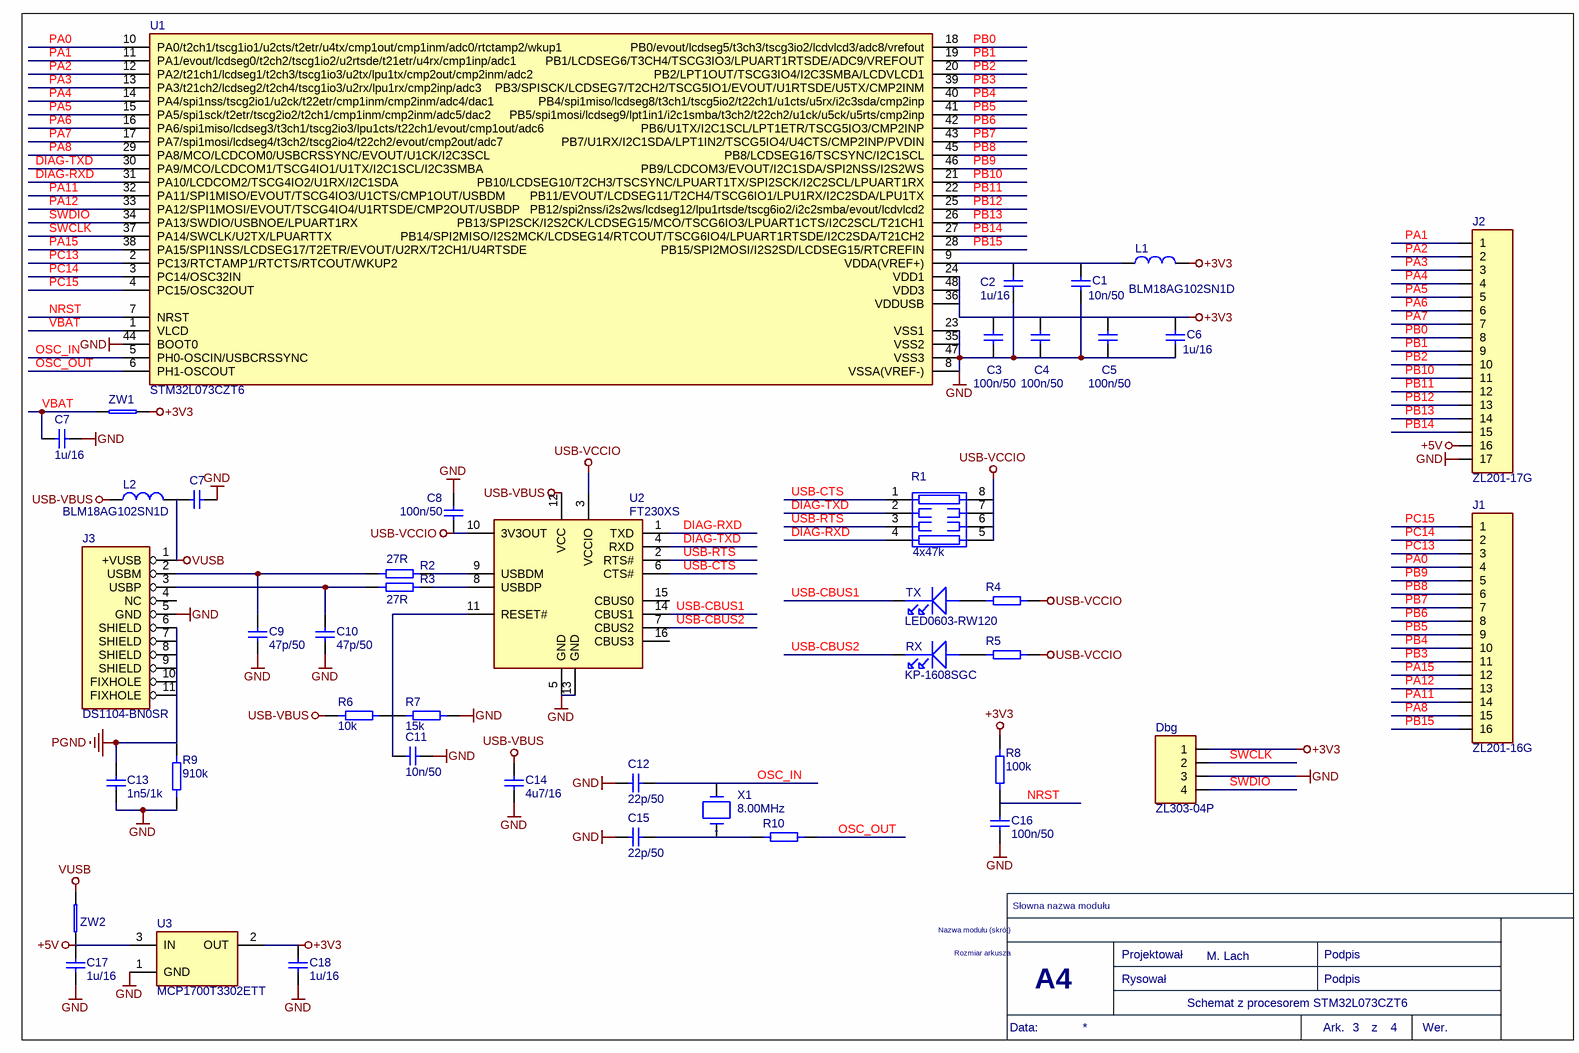
[diagram p2: stm32f103cb_hm_L073.SchDoc]

### Parts
(Parts that share a designator on the sheet are numbered #1, #2 ... from top to bottom, then left to right.)
C1#3  10n/50  [0603-IPC]  (graphical)
C2#3  1u/16  [0603-IPC]  (graphical)
C3#3  100n/50  [0603-IPC]  (graphical)
C4#3  100n/50  [0603-IPC]  (graphical)
C5#3  100n/50  [0603-IPC]  (graphical)
C6#3  1u/16  [0603-IPC]  (graphical)
C7#3  1u/16  [0603-IPC]  (graphical)
C7#4  10n/50  [0603-IPC]  (value not drawn)  (graphical)
C8#3  100n/50  [0603-IPC]  (graphical)
C9#3  47p/50  [0603-IPC]  (graphical)
C10#3  47p/50  [0603-IPC]  (graphical)
C11#3  10n/50  [0603-IPC]  (graphical)
C12#3  22p/50  [0603-IPC]  (graphical)
C13#3  1n5/1k  [1210]  (graphical)
C14#3  4u7/16  [0805]  (graphical)
C15#3  22p/50  [0603-IPC]  (graphical)
C16#3  100n/50  [0603-IPC]  (graphical)
C17#3  1u/16  [0603-IPC]  (graphical)
C18#3  1u/16  [0603-IPC]  (graphical)
Dbg#3  ZL303-04P  [PLMS4S]  (graphical)
J1#3  ZL201-16G  [PLS16S]  (graphical)
J2#3  ZL201-17G  [PLS17S]  (graphical)
J3#2  DS1104-BN0SR  [USBMS1B5]  (graphical)
L1#3  BLM18AG102SN1D  [0603-IPC]  (graphical)
L2#3  BLM18AG102SN1D  [0603-IPC]  (graphical)
R1#3  4x47k  [1206RP]  (graphical)
R2#3  27R  [0603R]  (graphical)
R3#3  27R  [0603R]  (graphical)
R4#3  10k  [0603R]  (value not drawn)  (graphical)
R5#3  10k  [0603R]  (value not drawn)  (graphical)
R6#3  10k  [0603R]  (graphical)
R7#3  15k  [0603R]  (graphical)
R8#3  100k  [0603R]  (graphical)
R9#3  910k  [2512]  (graphical)
R10#3  220R  [0603R]  (value not drawn)  (graphical)
RX#3  KP-1608SGC  [D0603]  (graphical)
TX#3  LED0603-RW120  [D0603]  (graphical)
U1#3  STM32L073CZT6  [MS-026ABC]  (graphical)
U2#3  FT230XS  [MO-137AB]  (graphical)
U3#3  MCP1700T3302ETT  [SOT23-3]  (graphical)
X1#3  8.00MHz  [HC49/4HSMX_THT]  (graphical)
ZW1#3  SHORT0805  [SHORT0805]  (value not drawn)  (graphical)
ZW2#3  SHORT0805  [SHORT0805]  (value not drawn)  (graphical)

### Nets
+3V3: C3#3.1 C4#3.1 C5#3.1 C6#3.1 C18#3.1 Dbg#3.1 L1#3.2 R8#3.1 U1#3.24(VDD1) U1#3.36(VDDUSB) U1#3.48(VDD3) U3#3.2(OUT) ZW1#3.2
+5V: C17#3.1 J2#3.16 U3#3.3(IN) ZW2#3.1
GND: C1#3.2 C2#3.2 C3#3.2 C4#3.2 C5#3.2 C6#3.2 C7#3.2 C7#4.1 C8#3.1 C9#3.2 C10#3.2 C11#3.1 C12#3.1 C13#3.2 C14#3.2 C15#3.1 C16#3.2 C17#3.2 C18#3.2 Dbg#3.3 J2#3.17 J3#2.5(GND) R7#3.2 R9#3.2 U1#3.8(VSSA(VREF-)) U1#3.23(VSS1) U1#3.35(VSS2) U1#3.44(BOOT0) U1#3.47(VSS3) U2#3.5(GND) U2#3.13(GND) U3#3.1(GND)
PGND: C13#3.1 J3#2.6(SHIELD) J3#2.7(SHIELD) J3#2.8(SHIELD) J3#2.9(SHIELD) J3#2.10(FIXHOLE) J3#2.11(FIXHOLE) R9#3.1
USB-VBUS: C14#3.1 L2#3.2 R6#3.1 U2#3.12(VCC)
USB-VCCIO: C8#3.2 R1#3.5(R5) R1#3.6(R6) R1#3.7(R7) R1#3.8(R8) R4#3.2 R5#3.2 U2#3.3(VCCIO) U2#3.10(3V3OUT)
VUSB: C7#4.2 J3#2.1(+VUSB) L2#3.1 ZW2#3.2
DIAG-RXD: R1#3.4(R4) U1#3.31(PA10/LCDCOM2/TSCG4IO2/U1RX/I2C1SDA) U2#3.1(TXD)
DIAG-TXD: R1#3.2(R2) U1#3.30(PA9/MCO/LCDCOM1/TSCG4IO1/U1TX/I2C1SCL/I2C3SMBA) U2#3.4(RXD)
NRST: C16#3.1 R8#3.2 U1#3.7(NRST)
OSC_IN: C12#3.2 U1#3.5(PH0-OSCIN/USBCRSSYNC) X1#3.1
OSC_OUT: R10#3.2 U1#3.6(PH1-OSCOUT)
PA0: J1#3.4 U1#3.10(PA0/t2ch1/tscg1io1/u2cts/t2etr/u4tx/cmp1out/cmp1inm/adc0/rtctamp2/wkup1)
PA1: J2#3.1 U1#3.11(PA1/evout/lcdseg0/t2ch2/tscg1io2/u2rtsde/t21etr/u4rx/cmp1inp/adc1)
PA2: J2#3.2 U1#3.12(PA2/t21ch1/lcdseg1/t2ch3/tscg1io3/u2tx/lpu1tx/cmp2out/cmp2inm/adc2)
PA3: J2#3.3 U1#3.13(PA3/t21ch2/lcdseg2/t2ch4/tscg1io3/u2rx/lpu1rx/cmp2inp/adc3)
PA4: J2#3.4 U1#3.14(PA4/spi1nss/tscg2io1/u2ck/t22etr/cmp1inm/cmp2inm/adc4/dac1)
PA5: J2#3.5 U1#3.15(PA5/spi1sck/t2etr/tscg2io2/t2ch1/cmp1inm/cmp2inm/adc5/dac2)
PA6: J2#3.6 U1#3.16(PA6/spi1miso/lcdseg3/t3ch1/tscg2io3/lpu1cts/t22ch1/evout/cmp1out/adc6)
PA7: J2#3.7 U1#3.17(PA7/spi1mosi/lcdseg4/t3ch2/tscg2io4/t22ch2/evout/cmp2out/adc7)
PA8: J1#3.15 U1#3.29(PA8/MCO/LCDCOM0/USBCRSSYNC/EVOUT/U1CK/I2C3SCL)
PA11: J1#3.14 U1#3.32(PA11/SPI1MISO/EVOUT/TSCG4IO3/U1CTS/CMP1OUT/USBDM)
PA12: J1#3.13 U1#3.33(PA12/SPI1MOSI/EVOUT/TSCG4IO4/U1RTSDE/CMP2OUT/USBDP)
PA15: J1#3.12 U1#3.38(PA15/SPI1NSS/LCDSEG17/T2ETR/EVOUT/U2RX/T2CH1/U4RTSDE)
PB0: J2#3.8 U1#3.18(PB0/evout/lcdseg5/t3ch3/tscg3io2/lcdvlcd3/adc8/vrefout)
PB1: J2#3.9 U1#3.19(PB1/LCDSEG6/T3CH4/TSCG3IO3/LPUART1RTSDE/ADC9/VREFOUT)
PB2: J2#3.10 U1#3.20(PB2/LPT1OUT/TSCG3IO4/I2C3SMBA/LCDVLCD1)
PB3: J1#3.11 U1#3.39(PB3/SPISCK/LCDSEG7/T2CH2/TSCG5IO1/EVOUT/U1RTSDE/U5TX/CMP2INM)
PB4: J1#3.10 U1#3.40(PB4/spi1miso/lcdseg8/t3ch1/tscg5io2/t22ch1/u1cts/u5rx/i2c3sda/cmp2inp)
PB5: J1#3.9 U1#3.41(PB5/spi1mosi/lcdseg9/lpt1in1/i2c1smba/t3ch2/t22ch2/u1ck/u5ck/u5rts/cmp2inp)
PB6: J1#3.8 U1#3.42(PB6/U1TX/I2C1SCL/LPT1ETR/TSCG5IO3/CMP2INP)
PB7: J1#3.7 U1#3.43(PB7/U1RX/I2C1SDA/LPT1IN2/TSCG5IO4/U4CTS/CMP2INP/PVDIN)
PB8: J1#3.6 U1#3.45(PB8/LCDSEG16/TSCSYNC/I2C1SCL)
PB9: J1#3.5 U1#3.46(PB9/LCDCOM3/EVOUT/I2C1SDA/SPI2NSS/I2S2WS)
PB10: J2#3.11 U1#3.21(PB10/LCDSEG10/T2CH3/TSCSYNC/LPUART1TX/SPI2SCK/I2C2SCL/LPUART1RX)
PB11: J2#3.12 U1#3.22(PB11/EVOUT/LCDSEG11/T2CH4/TSCG6IO1/LPU1RX/I2C2SDA/LPU1TX)
PB12: J2#3.13 U1#3.25(PB12/spi2nss/i2s2ws/lcdseg12/lpu1rtsde/tscg6io2/i2c2smba/evout/lcdvlcd2)
PB13: J2#3.14 U1#3.26(PB13/SPI2SCK/I2S2CK/LCDSEG15/MCO/TSCG6IO3/LPUART1CTS/I2C2SCL/T21CH1)
PB14: J2#3.15 U1#3.27(PB14/SPI2MISO/I2S2MCK/LCDSEG14/RTCOUT/TSCG6IO4/LPUART1RTSDE/I2C2SDA/T21CH2)
PB15: J1#3.16 U1#3.28(PB15/SPI2MOSI/I2S2SD/LCDSEG15/RTCREFIN)
PC13: J1#3.3 U1#3.2(PC13/RTCTAMP1/RTCTS/RTCOUT/WKUP2)
PC14: J1#3.2 U1#3.3(PC14/OSC32IN)
PC15: J1#3.1 U1#3.4(PC15/OSC32OUT)
SWCLK: Dbg#3.2 U1#3.37(PA14/SWCLK/U2TX/LPUARTTX)
SWDIO: Dbg#3.4 U1#3.34(PA13/SWDIO/USBNOE/LPUART1RX)
USB-CBUS1: TX#3.CATH U2#3.14(CBUS1)
USB-CBUS2: RX#3.CATH U2#3.7(CBUS2)
USB-CTS: R1#3.1(R1) U2#3.6(CTS#)
USB-RTS: R1#3.3(R3) U2#3.2(RTS#)
VBAT: C7#3.1 U1#3.1(VLCD) ZW1#3.1
NetC1#3_1: C1#3.1 C2#3.1 L1#3.1 U1#3.9(VDDA(VREF+))
NetC9#3_1: C9#3.1 J3#2.2(USBM) R2#3.1
NetC10#3_1: C10#3.1 J3#2.3(USBP) R3#3.1
NetC11#3_2: C11#3.2 R6#3.2 R7#3.1 U2#3.11(RESET#)
NetC15#3_2: C15#3.2 R10#3.1 X1#3.2
NetR2#3_2: R2#3.2 U2#3.9(USBDM)
NetR3#3_2: R3#3.2 U2#3.8(USBDP)
NetR4#3_1: R4#3.1 TX#3.ANOD
NetR5#3_1: R5#3.1 RX#3.ANOD

Not connected (* = marked no-connect by the designer): J3#2 4(NC); U2#3 15(CBUS0) 16(CBUS3)

### Notes on the sheet
- Nazwa modułu (skrót)
- Słowna nazwa modułu
- Rozmiar arkusza
- A4
- Projektował
- Rysował
- Podpis
- Data:
- Ark.
- z
- Wer.

### Library data of the parts
C1#3 C7#4 C11#3 = CAP20: as C2#1 on sheet stm32f103cb_hm_main; Value: 10n/50; Supplier5: tme.pl; Manufacturer5: AVX; Typ5: 06035C103KAT2A; Price5: 0,08; DateOfPrice5: 2020-05-10
C2#3 C6#3 C17#3 C18#3 = CAP37: as C1#1 on sheet stm32f103cb_hm_main; Value: 1u/16; Supplier5: tme.pl; Manufacturer5: Samsung; Typ5: CL10B105KO8NNNC; Price5: 0,07; DateOfPrice5: 2020-05-10
C3#3 C4#3 C5#3 C8#3 C16#3 = CAP6: as C4#1 on sheet stm32f103cb_hm_main; Value: 100n/50; Supplier5: tme.pl; Manufacturer5: Samsung; Typ5: CL10B104JB8NNNC; Price5: 0,25; DateOfPrice5: 2020-05-10
C7#3 = CAP37: as C7#1 on sheet stm32f103cb_hm_main; Value: 1u/16; Price5: 0,07; DateOfPrice5: 2020-05-10; Supplier5: tme.pl; Manufacturer5: Samsung; Typ5: CL10B105KO8NNNC
C9#3 C10#3 = CAP85: as C10#1 on sheet stm32f103cb_hm_main; Value: 47p/50; Supplier5: tme.pl; Manufacturer5: Yageo; Price5: 0,08; DateOfPrice5: 2020-05-10
C12#3 C15#3 = CAP53: as C13#1 on sheet stm32f103cb_hm_main; Value: 22p/50; Supplier5: tme.pl; Manufacturer5: Yageo; Price5: 0; DateOfPrice5: 2010-01-01
C13#3 = CAP35: as C14#1 on sheet stm32f103cb_hm_main; Value: 1n5/1k; DateOfPrice5: 2020-05-10; Manufacturer5: MULTICOMP; Price5: 2,4; Supplier5: farnell.com
C14#3 = CAP97: as C15#1 on sheet stm32f103cb_hm_main; Value: 4u7/16; Supplier5: tme.pl; Manufacturer5: Kemet; Typ5: C0805C475J4RACAUTO; Price5: 1,5; DateOfPrice5: 2020-05-10
Dbg#3 = Con298: as Dbg#1 on sheet stm32f103cb_hm_main; Value: ZL303-04P; Supplier5: tme.pl; Reference5: ZL303-04P; Manufacturer5: Ninigi; Typ5: ZL303-04P; Price5: 0,2; DateOfPrice5: 2020-05-10
J1#3 = CON81: as J1#2 on sheet stm32f103cb_hm_F100; Value: ZL201-16G; Price5: 0,7; DateOfPrice5: 2020-12-08; Supplier5: tme; Reference5: ZL201-16G; Manufacturer5: Connfly
J2#3 = CON82: as J1#1 on sheet stm32f103cb_hm_main; Value: ZL201-17G; Price5: 1; DateOfPrice5: 2020-12-08; Supplier5: tme; Manufacturer5: Connfly
J3#2 = Con41: as RS232USB on sheet stm32f103cb_hm_main; Value: DS1104-BN0SR; Supplier5: tme.pl; Manufacturer5: Connfly; Price5: 2; DateOfPrice5: 2010-01-01; Typ5: DS1104-BN0SR
L1#3 L2#3 = Ind41: as L1#1 on sheet stm32f103cb_hm_main; Value: BLM18AG102SN1D; Supplier5: tme.pl; Reference5: BLM18AG102SN1D; Manufacturer5: Murata; Typ5: BLM18AG102SN1D; Price5: 0; DateOfPrice5: 2020-05-10; InductCurr: -
R1#3 = Res182: as R1#1 on sheet stm32f103cb_hm_main; Value: 4x47k; Supplier5: tme.pl; Manufacturer5: Royal Ohm; Price5: 0,1; DateOfPrice5: 2020-05-10
R2#3 R3#3 = Res106: as R2#1 on sheet stm32f103cb_hm_main; Value: 27R; Supplier5: tme.pl; Manufacturer5: Royal Ohm; Price5: 0,1; DateOfPrice5: 2020-05-10
R4#3 R5#3 R6#3 = Res15: as R4#1 on sheet stm32f103cb_hm_main; Value: 10k; Supplier5: tme.pl; Manufacturer5: Royal Ohm; Price5: 0,08; DateOfPrice5: 2020-05-10
R7#3 = Res39: as R7#1 on sheet stm32f103cb_hm_main; Value: 15k; Supplier5: tme.pl; Manufacturer5: Royal Ohm; Price5: 0,08; DateOfPrice5: 2020-05-10
R8#3 = Res9: as R8#1 on sheet stm32f103cb_hm_main; Value: 100k; Supplier5: tme.pl; Manufacturer5: Royal Ohm; Price5: 0,1; DateOfPrice5: 2020-06-25
R9#3 = Res235: as R9#1 on sheet stm32f103cb_hm_main; Value: 910k; Supplier5: farnell; Price5: 1,14; DateOfPrice5: 2020-05-10; Manufacturer5: Panasonic
R10#3 = Res87: as R10#1 on sheet stm32f103cb_hm_main; Value: 220R; Supplier5: tme.pl; Manufacturer5: Royal Ohm; Price5: 0,1; DateOfPrice5: 2020-06-25
RX#3 = Opt8: as RX#1 on sheet stm32f103cb_hm_main; Value: KP-1608SGC; Supplier5: tme.pl; Reference5: KP-1608SGC; Manufacturer5: Kingbright Electronic; Typ5: KP-1608SGC; Price5: 0,8; DateOfPrice5: 2020-05-10
TX#3 = Opt25: as TX#1 on sheet stm32f103cb_hm_main; Value: LED0603-RW120; Supplier5: maritex.com.pl; Reference5: LED0603-RW120; Typ5: LED0603-RW120; Price5: 0,12; DateOfPrice5: 2020-05-10; Manufacturer5: Honglitronic
U1#3 = ICs284: Kod: ICs284; ID: 284; Descript: Mikrokontroler ARM, bardzo niska moc, STM32 L0 ARM Cortex-M0+ Microcontrollers, 32 bity, 32 MHz, 192kB flash; Reference5: 2518154; Value: STM32L073CZT6; Price5: 23; DateOfPrice5: 2010-01-01; Supplier5: farnell.com; Manufacturer5: ST; Typ5: STM32L073CZT6
U2#3 = ICs109: as U2#1 on sheet stm32f103cb_hm_main; Value: FT230XS; Supplier5: tme.pl; Manufacturer5: FTDI; Typ5: FT230XS-R; Price5: 8,8; DateOfPrice5: 2020-05-10
U3#3 = ICs182: as U3#1 on sheet stm32f103cb_hm_main; Value: MCP1700T3302ETT; Price5: 1,8; DateOfPrice5: 2020-05-10; Supplier5: tme.pl; Reference5: MCP1700T3302ETT; Manufacturer5: Microchip
X1#3 = Qua16: as X1#1 on sheet stm32f103cb_hm_main; Value: 8.00MHz; Supplier5: tme.pl; Manufacturer5: YIC; Price5: 2; DateOfPrice5: 2020-05-10; Freq: -
ZW1#3 ZW2#3 = Res238: as ZW1#1 on sheet stm32f103cb_hm_main; Value: SHORT0805; Price5: 0,1; Supplier5: -; Reference5: -; Manufacturer5: -; Typ5: -

## Sheet stm32f103cb_hm_F051.SchDoc: Schemat z procesorem STM32F051C8T6
size A4; DocumentNumber: 4; SheetNumber: 4; SheetTotal: 4; LotOfPieces: 1
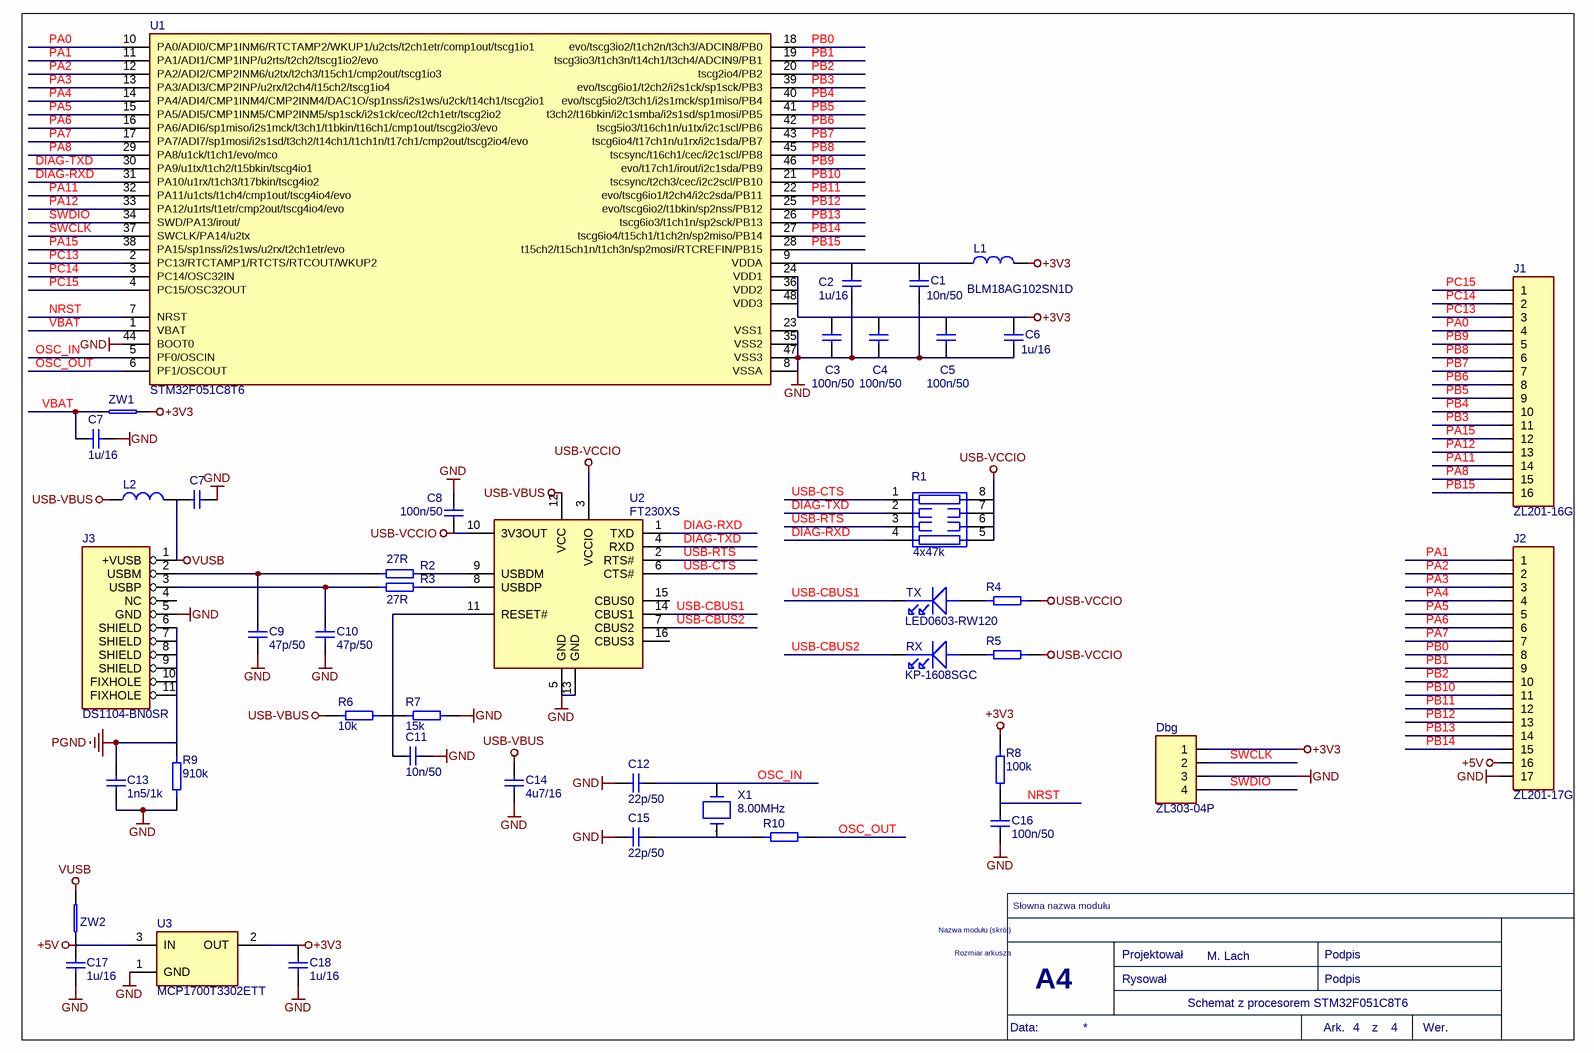
[diagram p3: stm32f103cb_hm_F051.SchDoc]

### Parts
(Parts that share a designator on the sheet are numbered #1, #2 ... from top to bottom, then left to right.)
C1#4  10n/50  [0603-IPC]  (graphical)
C2#4  1u/16  [0603-IPC]  (graphical)
C3#4  100n/50  [0603-IPC]  (graphical)
C4#4  100n/50  [0603-IPC]  (graphical)
C5#4  100n/50  [0603-IPC]  (graphical)
C6#4  1u/16  [0603-IPC]  (graphical)
C7#5  1u/16  [0603-IPC]  (graphical)
C7#6  10n/50  [0603-IPC]  (value not drawn)  (graphical)
C8#4  100n/50  [0603-IPC]  (graphical)
C9#4  47p/50  [0603-IPC]  (graphical)
C10#4  47p/50  [0603-IPC]  (graphical)
C11#4  10n/50  [0603-IPC]  (graphical)
C12#4  22p/50  [0603-IPC]  (graphical)
C13#4  1n5/1k  [1210]  (graphical)
C14#4  4u7/16  [0805]  (graphical)
C15#4  22p/50  [0603-IPC]  (graphical)
C16#4  100n/50  [0603-IPC]  (graphical)
C17#4  1u/16  [0603-IPC]  (graphical)
C18#4  1u/16  [0603-IPC]  (graphical)
Dbg#4  ZL303-04P  [PLMS4S]  (graphical)
J1#4  ZL201-16G  [PLS16S]  (graphical)
J2#4  ZL201-17G  [PLS17S]  (graphical)
J3#3  DS1104-BN0SR  [USBMS1B5]  (graphical)
L1#4  BLM18AG102SN1D  [0603-IPC]  (graphical)
L2#4  BLM18AG102SN1D  [0603-IPC]  (value not drawn)  (graphical)
R1#4  4x47k  [1206RP]  (graphical)
R2#4  27R  [0603R]  (graphical)
R3#4  27R  [0603R]  (graphical)
R4#4  10k  [0603R]  (value not drawn)  (graphical)
R5#4  10k  [0603R]  (value not drawn)  (graphical)
R6#4  10k  [0603R]  (graphical)
R7#4  15k  [0603R]  (graphical)
R8#4  100k  [0603R]  (graphical)
R9#4  910k  [2512]  (graphical)
R10#4  220R  [0603R]  (value not drawn)  (graphical)
RX#4  KP-1608SGC  [D0603]  (graphical)
TX#4  LED0603-RW120  [D0603]  (graphical)
U1#4  STM32F051C8T6  [MS-026ABC]  (graphical)
U2#4  FT230XS  [MO-137AB]  (graphical)
U3#4  MCP1700T3302ETT  [SOT23-3]  (graphical)
X1#4  8.00MHz  [HC49/4HSMX_THT]  (graphical)
ZW1#4  SHORT0805  [SHORT0805]  (value not drawn)  (graphical)
ZW2#4  SHORT0805  [SHORT0805]  (value not drawn)  (graphical)

### Nets
+3V3: C3#4.1 C4#4.1 C5#4.1 C6#4.1 C18#4.1 Dbg#4.1 L1#4.2 R8#4.1 U1#4.24(VDD1) U1#4.36(VDD2) U1#4.48(VDD3) U3#4.2(OUT) ZW1#4.2
+5V: C17#4.1 J2#4.16 U3#4.3(IN) ZW2#4.1
GND: C1#4.2 C2#4.2 C3#4.2 C4#4.2 C5#4.2 C6#4.2 C7#5.2 C7#6.1 C8#4.1 C9#4.2 C10#4.2 C11#4.1 C12#4.1 C13#4.2 C14#4.2 C15#4.1 C16#4.2 C17#4.2 C18#4.2 Dbg#4.3 J2#4.17 J3#3.5(GND) R7#4.2 R9#4.2 U1#4.8(VSSA) U1#4.23(VSS1) U1#4.35(VSS2) U1#4.44(BOOT0) U1#4.47(VSS3) U2#4.5(GND) U2#4.13(GND) U3#4.1(GND)
PGND: C13#4.1 J3#3.6(SHIELD) J3#3.7(SHIELD) J3#3.8(SHIELD) J3#3.9(SHIELD) J3#3.10(FIXHOLE) J3#3.11(FIXHOLE) R9#4.1
USB-VBUS: C14#4.1 L2#4.2 R6#4.1 U2#4.12(VCC)
USB-VCCIO: C8#4.2 R1#4.5(R5) R1#4.6(R6) R1#4.7(R7) R1#4.8(R8) R4#4.2 R5#4.2 U2#4.3(VCCIO) U2#4.10(3V3OUT)
VUSB: C7#6.2 J3#3.1(+VUSB) L2#4.1 ZW2#4.2
DIAG-RXD: R1#4.4(R4) U1#4.31(PA10/u1rx/t1ch3/t17bkin/tscg4io2) U2#4.1(TXD)
DIAG-TXD: R1#4.2(R2) U1#4.30(PA9/u1tx/t1ch2/t15bkin/tscg4io1) U2#4.4(RXD)
NRST: C16#4.1 R8#4.2 U1#4.7(NRST)
OSC_IN: C12#4.2 U1#4.5(PF0/OSCIN) X1#4.1
OSC_OUT: R10#4.2 U1#4.6(PF1/OSCOUT)
PA0: J1#4.4 U1#4.10(PA0/ADI0/CMP1INM6/RTCTAMP2/WKUP1/u2cts/t2ch1etr/comp1out/tscg1io1)
PA1: J2#4.1 U1#4.11(PA1/ADI1/CMP1INP/u2rts/t2ch2/tscg1io2/evo)
PA2: J2#4.2 U1#4.12(PA2/ADI2/CMP2INM6/u2tx/t2ch3/t15ch1/cmp2out/tscg1io3)
PA3: J2#4.3 U1#4.13(PA3/ADI3/CMP2INP/u2rx/t2ch4/t15ch2/tscg1io4)
PA4: J2#4.4 U1#4.14(PA4/ADI4/CMP1INM4/CMP2INM4/DAC1O/sp1nss/i2s1ws/u2ck/t14ch1/tscg2io1)
PA5: J2#4.5 U1#4.15(PA5/ADI5/CMP1INM5/CMP2INM5/sp1sck/i2s1ck/cec/t2ch1etr/tscg2io2)
PA6: J2#4.6 U1#4.16(PA6/ADI6/sp1miso/i2s1mck/t3ch1/t1bkin/t16ch1/cmp1out/tscg2io3/evo)
PA7: J2#4.7 U1#4.17(PA7/ADI7/sp1mosi/i2s1sd/t3ch2/t14ch1/t1ch1n/t17ch1/cmp2out/tscg2io4/evo)
PA8: J1#4.15 U1#4.29(PA8/u1ck/t1ch1/evo/mco)
PA11: J1#4.14 U1#4.32(PA11/u1cts/t1ch4/cmp1out/tscg4io4/evo)
PA12: J1#4.13 U1#4.33(PA12/u1rts/t1etr/cmp2out/tscg4io4/evo)
PA15: J1#4.12 U1#4.38(PA15/sp1nss/i2s1ws/u2rx/t2ch1etr/evo)
PB0: J2#4.8 U1#4.18(evo/tscg3io2/t1ch2n/t3ch3/ADCIN8/PB0)
PB1: J2#4.9 U1#4.19(tscg3io3/t1ch3n/t14ch1/t3ch4/ADCIN9/PB1)
PB2: J2#4.10 U1#4.20(tscg2io4/PB2)
PB3: J1#4.11 U1#4.39(evo/tscg6io1/t2ch2/i2s1ck/sp1sck/PB3)
PB4: J1#4.10 U1#4.40(evo/tscg5io2/t3ch1/i2s1mck/sp1miso/PB4)
PB5: J1#4.9 U1#4.41(t3ch2/t16bkin/i2c1smba/i2s1sd/sp1mosi/PB5)
PB6: J1#4.8 U1#4.42(tscg5io3/t16ch1n/u1tx/i2c1scl/PB6)
PB7: J1#4.7 U1#4.43(tscg6io4/t17ch1n/u1rx/i2c1sda/PB7)
PB8: J1#4.6 U1#4.45(tscsync/t16ch1/cec/i2c1scl/PB8)
PB9: J1#4.5 U1#4.46(evo/t17ch1/irout/i2c1sda/PB9)
PB10: J2#4.11 U1#4.21(tscsync/t2ch3/cec/i2c2scl/PB10)
PB11: J2#4.12 U1#4.22(evo/tscg6io1/t2ch4/i2c2sda/PB11)
PB12: J2#4.13 U1#4.25(evo/tscg6io2/t1bkin/sp2nss/PB12)
PB13: J2#4.14 U1#4.26(tscg6io3/t1ch1n/sp2sck/PB13)
PB14: J2#4.15 U1#4.27(tscg6io4/t15ch1/t1ch2n/sp2miso/PB14)
PB15: J1#4.16 U1#4.28(t15ch2/t15ch1n/t1ch3n/sp2mosi/RTCREFIN/PB15)
PC13: J1#4.3 U1#4.2(PC13/RTCTAMP1/RTCTS/RTCOUT/WKUP2)
PC14: J1#4.2 U1#4.3(PC14/OSC32IN)
PC15: J1#4.1 U1#4.4(PC15/OSC32OUT)
SWCLK: Dbg#4.2 U1#4.37(SWCLK/PA14/u2tx)
SWDIO: Dbg#4.4 U1#4.34(SWD/PA13/irout/)
USB-CBUS1: TX#4.CATH U2#4.14(CBUS1)
USB-CBUS2: RX#4.CATH U2#4.7(CBUS2)
USB-CTS: R1#4.1(R1) U2#4.6(CTS#)
USB-RTS: R1#4.3(R3) U2#4.2(RTS#)
VBAT: C7#5.1 U1#4.1(VBAT) ZW1#4.1
NetC1#4_1: C1#4.1 C2#4.1 L1#4.1 U1#4.9(VDDA)
NetC9#4_1: C9#4.1 J3#3.2(USBM) R2#4.1
NetC10#4_1: C10#4.1 J3#3.3(USBP) R3#4.1
NetC11#4_2: C11#4.2 R6#4.2 R7#4.1 U2#4.11(RESET#)
NetC15#4_2: C15#4.2 R10#4.1 X1#4.2
NetR2#4_2: R2#4.2 U2#4.9(USBDM)
NetR3#4_2: R3#4.2 U2#4.8(USBDP)
NetR4#4_1: R4#4.1 TX#4.ANOD
NetR5#4_1: R5#4.1 RX#4.ANOD

Not connected (* = marked no-connect by the designer): J3#3 4(NC); U2#4 15(CBUS0) 16(CBUS3)

### Notes on the sheet
- Nazwa modułu (skrót)
- Słowna nazwa modułu
- Rozmiar arkusza
- A4
- Projektował
- Rysował
- Podpis
- Data:
- Ark.
- z
- Wer.

### Library data of the parts
C1#4 C7#6 C11#4 = CAP20: as C2#1 on sheet stm32f103cb_hm_main; Value: 10n/50; Supplier5: tme.pl; Manufacturer5: AVX; Typ5: 06035C103KAT2A; Price5: 0,08; DateOfPrice5: 2020-05-10
C2#4 C6#4 C17#4 C18#4 = CAP37: as C1#1 on sheet stm32f103cb_hm_main; Value: 1u/16; Supplier5: tme.pl; Manufacturer5: Samsung; Typ5: CL10B105KO8NNNC; Price5: 0,07; DateOfPrice5: 2020-05-10
C3#4 C4#4 C5#4 C8#4 C16#4 = CAP6: as C4#1 on sheet stm32f103cb_hm_main; Value: 100n/50; Supplier5: tme.pl; Manufacturer5: Samsung; Typ5: CL10B104JB8NNNC; Price5: 0,25; DateOfPrice5: 2020-05-10
C7#5 = CAP37: as C7#1 on sheet stm32f103cb_hm_main; Value: 1u/16; Price5: 0,07; DateOfPrice5: 2020-05-10; Supplier5: tme.pl; Manufacturer5: Samsung; Typ5: CL10B105KO8NNNC
C9#4 C10#4 = CAP85: as C10#1 on sheet stm32f103cb_hm_main; Value: 47p/50; Supplier5: tme.pl; Manufacturer5: Yageo; Price5: 0,08; DateOfPrice5: 2020-05-10
C12#4 C15#4 = CAP53: as C13#1 on sheet stm32f103cb_hm_main; Value: 22p/50; Supplier5: tme.pl; Manufacturer5: Yageo; Price5: 0; DateOfPrice5: 2010-01-01
C13#4 = CAP35: as C14#1 on sheet stm32f103cb_hm_main; Value: 1n5/1k; DateOfPrice5: 2020-05-10; Manufacturer5: MULTICOMP; Price5: 2,4; Supplier5: farnell.com
C14#4 = CAP97: as C15#1 on sheet stm32f103cb_hm_main; Value: 4u7/16; Supplier5: tme.pl; Manufacturer5: Kemet; Typ5: C0805C475J4RACAUTO; Price5: 1,5; DateOfPrice5: 2020-05-10
Dbg#4 = Con298: as Dbg#1 on sheet stm32f103cb_hm_main; Value: ZL303-04P; Supplier5: tme.pl; Reference5: ZL303-04P; Manufacturer5: Ninigi; Typ5: ZL303-04P; Price5: 0,2; DateOfPrice5: 2020-05-10
J1#4 = CON81: as J1#2 on sheet stm32f103cb_hm_F100; Value: ZL201-16G; Price5: 0,7; DateOfPrice5: 2020-12-08; Supplier5: tme; Reference5: ZL201-16G; Manufacturer5: Connfly
J2#4 = CON82: as J1#1 on sheet stm32f103cb_hm_main; Value: ZL201-17G; Price5: 1; DateOfPrice5: 2020-12-08; Supplier5: tme; Manufacturer5: Connfly
J3#3 = Con41: as RS232USB on sheet stm32f103cb_hm_main; Value: DS1104-BN0SR; Supplier5: tme.pl; Manufacturer5: Connfly; Price5: 2; DateOfPrice5: 2010-01-01; Typ5: DS1104-BN0SR
L1#4 L2#4 = Ind41: as L1#1 on sheet stm32f103cb_hm_main; Value: BLM18AG102SN1D; Supplier5: tme.pl; Reference5: BLM18AG102SN1D; Manufacturer5: Murata; Typ5: BLM18AG102SN1D; Price5: 0; DateOfPrice5: 2020-05-10; InductCurr: -
R1#4 = Res182: as R1#1 on sheet stm32f103cb_hm_main; Value: 4x47k; Supplier5: tme.pl; Manufacturer5: Royal Ohm; Price5: 0,1; DateOfPrice5: 2020-05-10
R2#4 R3#4 = Res106: as R2#1 on sheet stm32f103cb_hm_main; Value: 27R; Supplier5: tme.pl; Manufacturer5: Royal Ohm; Price5: 0,1; DateOfPrice5: 2020-05-10
R4#4 R5#4 R6#4 = Res15: as R4#1 on sheet stm32f103cb_hm_main; Value: 10k; Supplier5: tme.pl; Manufacturer5: Royal Ohm; Price5: 0,08; DateOfPrice5: 2020-05-10
R7#4 = Res39: as R7#1 on sheet stm32f103cb_hm_main; Value: 15k; Supplier5: tme.pl; Manufacturer5: Royal Ohm; Price5: 0,08; DateOfPrice5: 2020-05-10
R8#4 = Res9: as R8#1 on sheet stm32f103cb_hm_main; Value: 100k; Supplier5: tme.pl; Manufacturer5: Royal Ohm; Price5: 0,1; DateOfPrice5: 2020-06-25
R9#4 = Res235: as R9#1 on sheet stm32f103cb_hm_main; Value: 910k; Supplier5: farnell; Price5: 1,14; DateOfPrice5: 2020-05-10; Manufacturer5: Panasonic
R10#4 = Res87: as R10#1 on sheet stm32f103cb_hm_main; Value: 220R; Supplier5: tme.pl; Manufacturer5: Royal Ohm; Price5: 0,1; DateOfPrice5: 2020-06-25
RX#4 = Opt8: as RX#1 on sheet stm32f103cb_hm_main; Value: KP-1608SGC; Supplier5: tme.pl; Reference5: KP-1608SGC; Manufacturer5: Kingbright Electronic; Typ5: KP-1608SGC; Price5: 0,8; DateOfPrice5: 2020-05-10
TX#4 = Opt25: as TX#1 on sheet stm32f103cb_hm_main; Value: LED0603-RW120; Supplier5: maritex.com.pl; Reference5: LED0603-RW120; Typ5: LED0603-RW120; Price5: 0,12; DateOfPrice5: 2020-05-10; Manufacturer5: Honglitronic
U1#4 = ICs112: Kod: ICs112; ID: 112; Descript: Mikrokontroler ARM Cortex M0; Flash:64kB; 48MHz; SRAM:8kB; Reference5: 497-12893-ND; Value: STM32F051C8T6; Price5: 16; DateOfPrice5: 2020-12-13; Supplier5: digikey; Manufacturer5: ST; Typ5: STM32F051C8T6
U2#4 = ICs109: as U2#1 on sheet stm32f103cb_hm_main; Value: FT230XS; Supplier5: tme.pl; Manufacturer5: FTDI; Typ5: FT230XS-R; Price5: 8,8; DateOfPrice5: 2020-05-10
U3#4 = ICs182: as U3#1 on sheet stm32f103cb_hm_main; Value: MCP1700T3302ETT; Price5: 1,8; DateOfPrice5: 2020-05-10; Supplier5: tme.pl; Reference5: MCP1700T3302ETT; Manufacturer5: Microchip
X1#4 = Qua16: as X1#1 on sheet stm32f103cb_hm_main; Value: 8.00MHz; Supplier5: tme.pl; Manufacturer5: YIC; Price5: 2; DateOfPrice5: 2020-05-10; Freq: -
ZW1#4 ZW2#4 = Res238: as ZW1#1 on sheet stm32f103cb_hm_main; Value: SHORT0805; Price5: 0,1; Supplier5: -; Reference5: -; Manufacturer5: -; Typ5: -